# EAGLE design c3_m_4x4 (EAGLE 5.11)
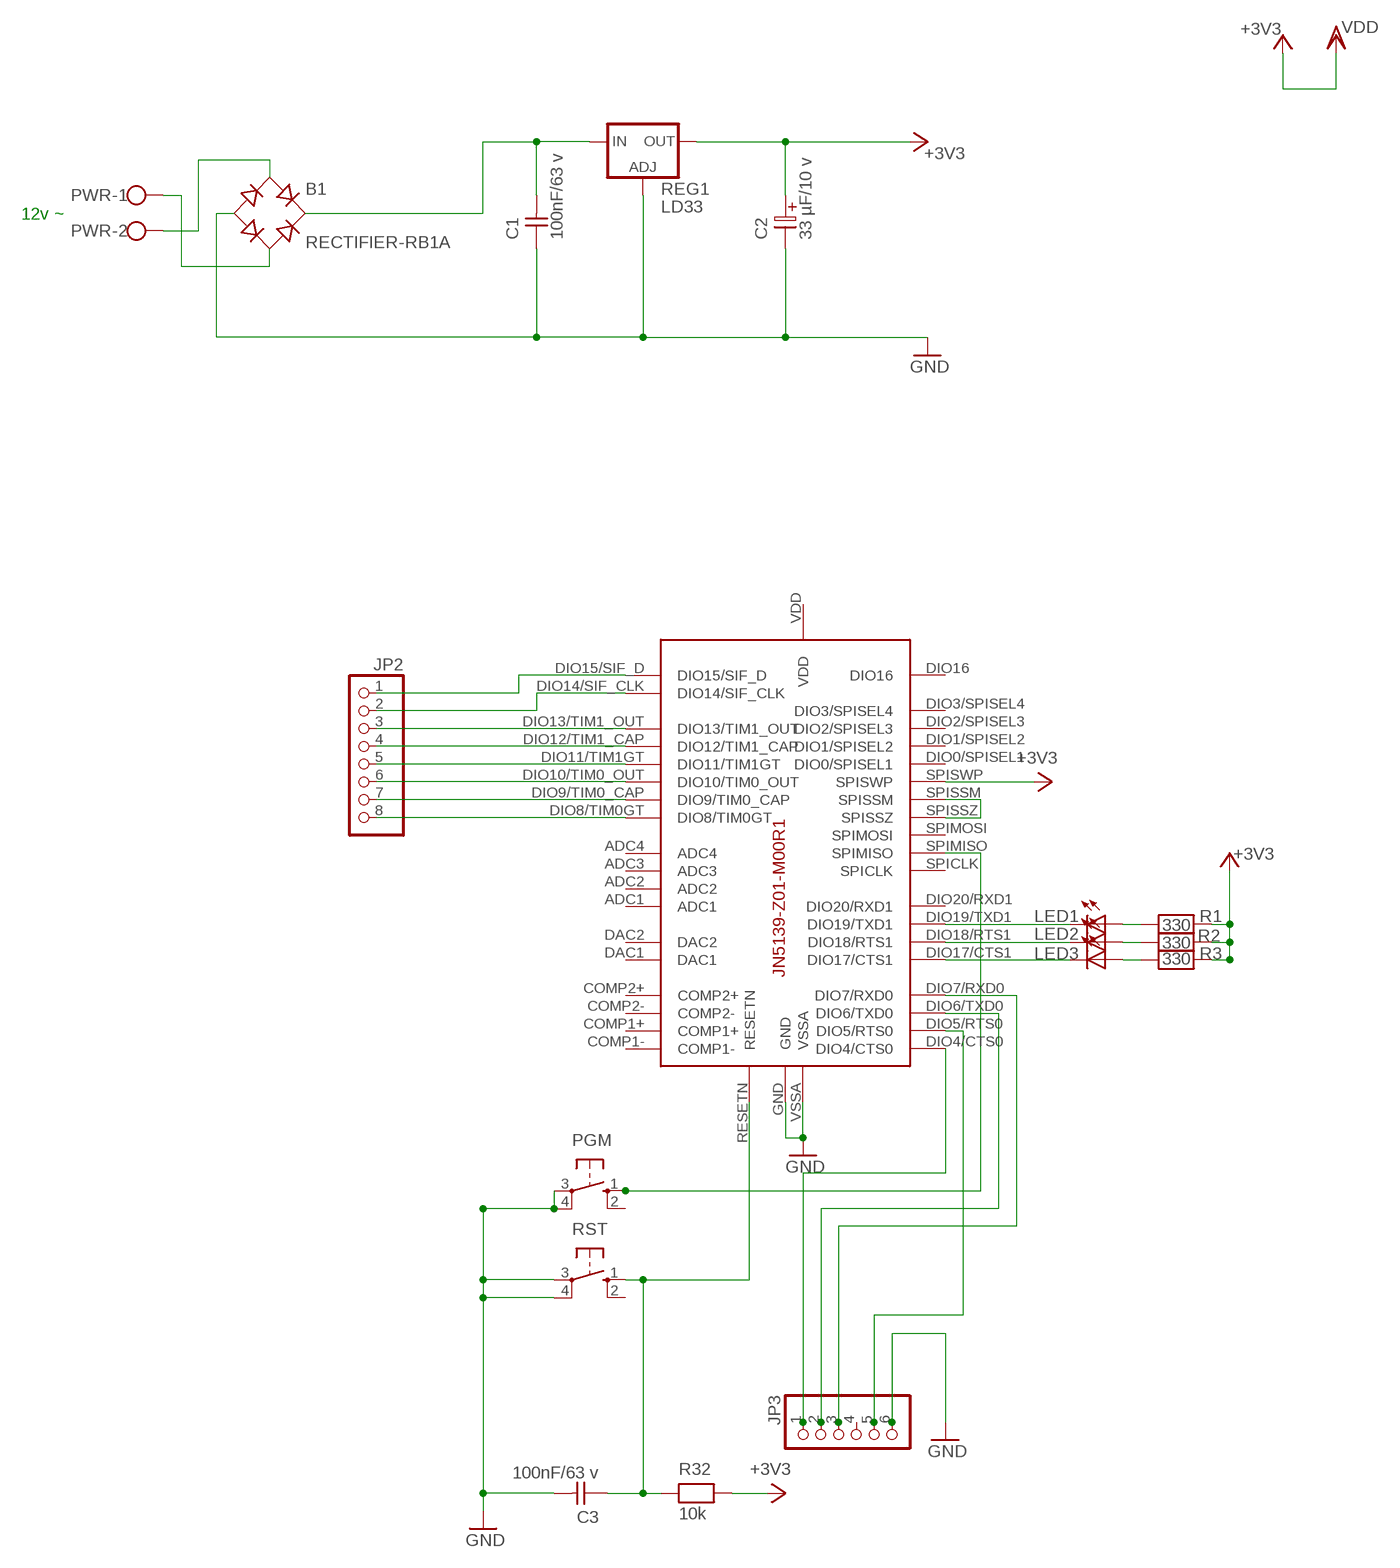
[diagram p0: schematic, sheet 1]

## Parts
B1  RECTIFIER-RB1A  [RB1A]
C1  100nF/63 v  CAPNP-5  [C-5]
C2  33 µF/10 v  ELC-2,5L  [ES-2,5L]
C3  100nF/63 v  CAPNP-5  [C-5]
JP2  PINHD-1X8/90  [1X08/90]
JP3  PINHD-1X6/90  [1X06/90]
LED1  LED5MM  [LED5MM]
LED2  LED5MM  [LED5MM]
LED3  LED5MM  [LED5MM]
PGM  10-XX  [B3F-10XX]
PWR  AK550/2  [AK550/2]
R1  330  RESEU-7,5  [R-7,5]
R2  330  RESEU-7,5  [R-7,5]
R3  330  RESEU-7,5  [R-7,5]
R32  10k  RESEU-7,5  [R-7,5]
REG1  LD33  LM317MBTG  [TO220L1]
RST  10-XX  [B3F-10XX]
U1  JN5139-Z01-M00R1  [JENNIC5139MODULE]

## Nets
+3V3: C2.1 R1.2 R2.2 R3.2 R32.2 REG1.2(OUT) U1.SPISWP ; supply symbol labelled VDD
GND: B1.- C1.1 C2.2 C3.2 JP3.6 PGM.3(P) PGM.4(P1) REG1.1(ADJ) RST.3(P) RST.4(P1) U1.GND U1.VSSA
N$1: JP2.8 U1.DIO8/TIM0GT
N$3: B1.+ C1.2 REG1.3(IN)
N$4: B1.AC1 PWR.2
N$5: B1.AC2 PWR.1
N$6: JP2.7 U1.DIO9/TIM0_CAP
N$7: C3.1 R32.1 RST.1(S) U1.RESETN
N$8: JP2.6 U1.DIO10/TIM0_OUT
N$9: JP2.5 U1.DIO11/TIM1GT
N$10: JP2.4 U1.DIO12/TIM1_CAP
N$11: U1.SPISSM U1.SPISSZ
N$12: JP2.3 U1.DIO13/TIM1_OUT
N$13: JP2.2 U1.DIO14/SIF_CLK
N$14: JP2.1 U1.DIO15/SIF_D
N$15: LED3.K(C) U1.DIO17/CTS1
N$16: LED2.K(C) U1.DIO18/RTS1
N$17: LED1.K(C) U1.DIO19/TXD1
N$18: LED1.A R1.1
N$19: LED2.A R2.1
N$20: LED3.A R3.1
N$67: JP3.2 U1.DIO6/TXD0
N$70: PGM.1(S) U1.SPIMISO
N$73: JP3.1 U1.DIO4/CTS0
N$74: JP3.5 U1.DIO5/RTS0
N$77: JP3.3 U1.DIO7/RXD0
Unconnected: JP3.4 PGM.2(S1) RST.2(S1) U1.ADC1 U1.ADC2 U1.ADC3 U1.ADC4 U1.COMP1+ U1.COMP1- U1.COMP2+ U1.COMP2- U1.DAC1 U1.DAC2 U1.DIO0/SPISEL1 U1.DIO1/SPISEL2 U1.DIO2/SPISEL3 U1.DIO3/SPISEL4 U1.DIO16 U1.DIO20/RXD1 U1.SPICLK U1.SPIMOSI

## Notes on the sheet
- 12v ~

## Power pins joined to a net without a drawn wire
+3V3: U1.VDD

## Library data of the parts
B1 = rectifier:RECTIFIER-: Rectifier
C1 C3 = discrete:CAPNP-5
C2 = discrete:ELC-2,5L
JP2 = pinhead:PINHD-1X8: PIN HEADER
JP3 = pinhead:PINHD-1X6: PIN HEADER
LED1-LED3 = led:LED: LED OSRAM: - CHIPLED LG R971, LG N971, LY N971, LG Q971, LY Q971, LO R971, LY R971 LH N974, LH R974 LS Q976, LO Q976, LY Q976 LO Q996 - Hyper CHIPLED LW Q18S LB Q993, LB Q99A, LB R99A - SideLED LS A670, LO A670, LY A670, LG A670, LP A670 LB A673, LV A673, LT A673, LW A673 LH A674 LY A675 LS A676, LA A676, LO A676, LY A676, LW A676 LS A679, LY A679, LG A679 - Hyper Micro SIDELED® LS Y876, LA Y876, LO Y876, LY Y876 LT Y87S - SmartLED LW L88C, LW L88S LB L89C, LB L89S, LG L890 LS L89K, LO L89K, LY L89K LS L896, LA L896, LO L896, LY L896 - TOPLED LS T670, LO T670, LY T670, LG T670, LP T670 LSG T670, LSP T670, LSY T670, LOP T670, LYG T670 LG T671, LOG T671, LSG T671 LB T673, LV T673, LT T673, LW T673 LH T674 LS T676, LA T676, LO T676, LY T676, LB T676, LH T676, LSB T676, LW T676 LB T67C, LV T67C, LT T67C, LS T67K, LO T67K, LY T67K, LW E67C LS E67B, LA E67B, LO E67B, LY E67B, LB E67C, LV E67C, LT E67C LW T67C LS T679, LY T679, LG T679 LS T770, LO T770, LY T770, LG T770, LP T770 LB T773, LV T773, LT T773, LW T773 LH T774 LS E675, LA E675, LY E675, LS T675 LS T776, LA T776, LO T776, LY T776, LB T776 LHGB T686 LT T68C, LB T68C - Hyper Mini TOPLED® LB M676 - Mini TOPLED Santana® LG M470 LS M47K, LO M47K, LY M47K Source: http://www.osram.convergy.de LUXEON: - LUMILED® LXK2-PW12-R00, LXK2-PW12-S00, LXK2-PW14-U00, LXK2-PW14-V00 LXK2-PM12-R00, LXK2-PM12-S00, LXK2-PM14-U00 LXK2-PE12-Q00, LXK2-PE12-R00, LXK2-PE12-S00, LXK2-PE14-T00, LXK2-PE14-U00 LXK2-PB12-K00, LXK2-PB12-L00, LXK2-PB12-M00, LXK2-PB14-N00, LXK2-PB14-P00, LXK2-PB14-Q00 LXK2-PR12-L00, LXK2-PR12-M00, LXK2-PR14-Q00, LXK2-PR14-R00 LXK2-PD12-Q00, LXK2-PD12-R00, LXK2-PD12-S00 LXK2-PH12-R00, LXK2-PH12-S00 LXK2-PL12-P00, LXK2-PL12-Q00, LXK2-PL12-R00 Source: www.luxeon.com KINGBRIGHT: KA-3528ASYC Source: www.kingbright.com
PGM RST = switch-omron:10-XX: OMRON SWITCH; MPN: B3F-1000; OC_FARNELL: 176432; OC_NEWARK: 36M3542
PWR = con-ptr500+:AK550/2: CONNECTOR
R1-R3 R32 = discrete:RESEU-7,5
REG1 = v-reg:LM317?*: 500 mA Adjustable Output Positive Voltage Regulator Source: http://www.onsemi.co.jp .. LM317M-D.PDF
U1 = jennic:JN5139-Z01-M00R1: Jennic 5139 Zigbee Module

## Net classes
0 default: width 0.406 mm, drill 0.6 mm, clearance 0.254 mm
1 AC_VOLTAGE: width 0.254 mm, drill 0.6 mm, clearance 0.254 mm
2 AC_TERRE: width 1.422 mm, clearance 0.254 mm

## Board
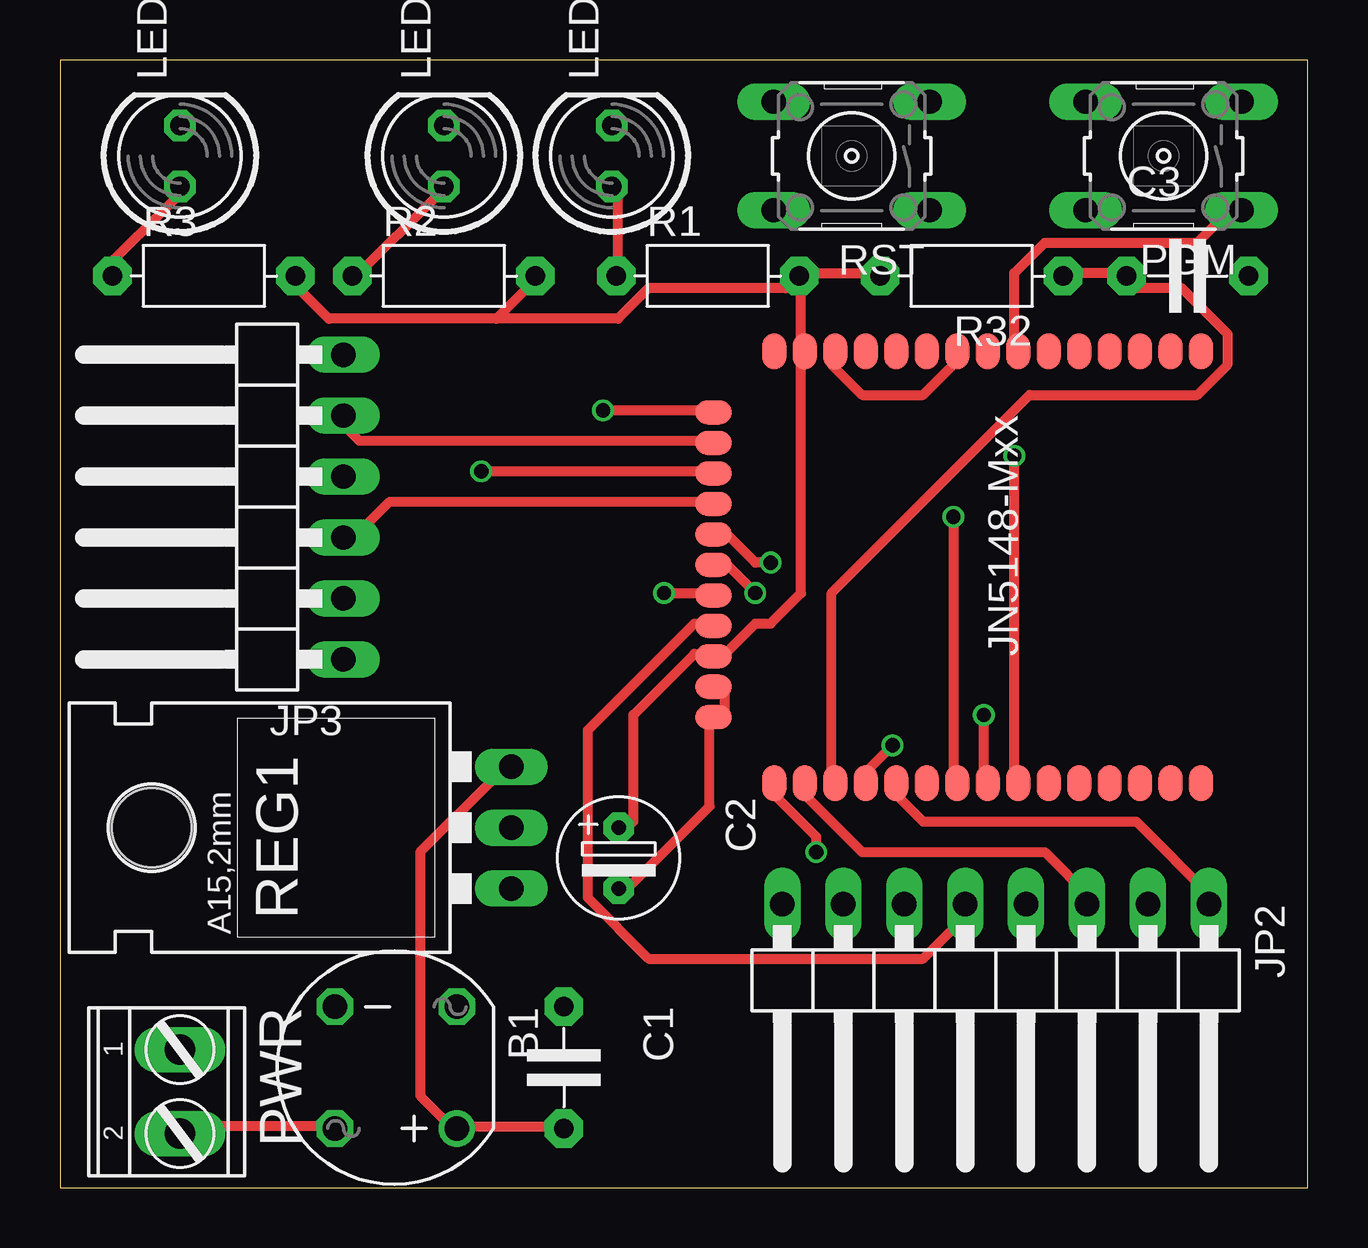
[diagram p1: board, top side]
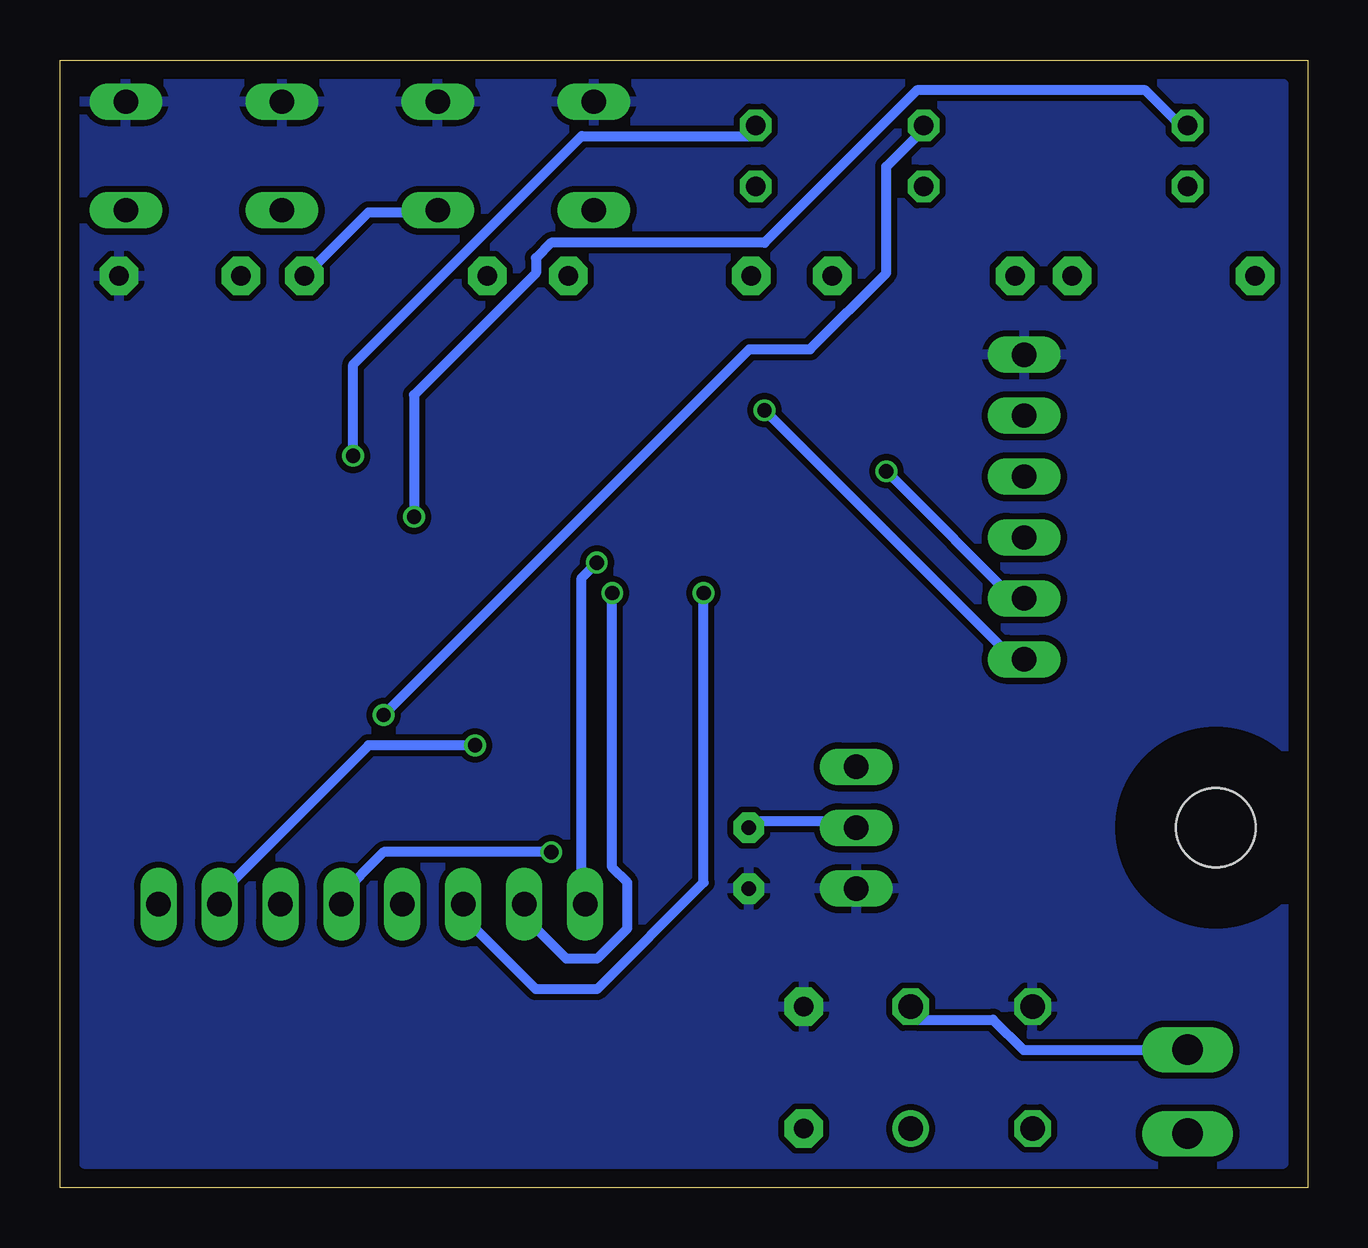
[diagram p2: board, bottom side, seen from below]

Size 52 x 47 mm. Coordinates in mm from the lower left corner, seen from the top.
Outline: 0,0 52,0 52,47 0,47 0,0
Copper layers (1*16): Top 0.035mm / dielectric 1.5mm / Bottom 0.035mm
Design rules "ElecFreaks_CAM_DRC_V1.0": minimum track width 6mil, minimum drill 12mil, track to track 6mil, track to pad 6mil, pad to pad 6mil, via to via 6mil, smd to smd 0mil, copper to edge 10mil, drill to drill 10mil, minimum pad ring 10mil, minimum via ring 6mil, stop-mask expansion 2mil, vias tented up to drill 100mil, thermal gap 10mil

### Footprints (pad centres in the part's own frame; a part is rotated, then mirrored left to right if it is on the bottom)
RB1A = drill 1.016 round: + -2.54,2.54 | drill 1.016 octagon: - 2.54,-2.54; AC1 2.54,2.54; AC2 -2.54,-2.54
C-5 = drill 0.813 pad 1.6 octagon: 1 -2.54,0; 2 2.54,0
ES-2,5L = drill 0.61 pad 1.27 octagon: 1 0,0; 2 2.54,0
1X08/90 = drill 1.016 long: 1 -8.89,-3.81; 2 -6.35,-3.81; 3 -3.81,-3.81; 4 -1.27,-3.81; 5 1.27,-3.81; 6 3.81,-3.81; 7 6.35,-3.81; 8 8.89,-3.81
1X06/90 = drill 1.016 long: 1 -6.35,-3.81; 2 -3.81,-3.81; 3 -1.27,-3.81; 4 1.27,-3.81; 5 3.81,-3.81; 6 6.35,-3.81
LED5MM = drill 0.813 octagon: A -1.27,0; K 1.27,0
B3F-10XX = drill 1.016 long: 1 -3.251,2.261; 2 3.251,2.261; 3 -3.251,-2.261; 4 3.251,-2.261
AK550/2 = drill 1.27 long: 1 -1.75,0; 2 1.75,0
R-7,5 = drill 0.813 pad 1.6 octagon: 1 -3.81,0; 2 3.81,0
TO220L1 = drill 1.016 long: 1 -2.54,-3.81; 2 0,-3.81; 3 2.54,-3.81 | hole 3.302: 0,11.176
JENNIC5139MODULE = smd 1.5 x 1: ADC1 18,17.78; ADC2 18,19.05; ADC3 18,20.32; ADC4 0,20.32; COMP1+ 18,16.51; COMP1- 18,15.24; COMP2+ 0,16.51; COMP2- 0,15.24; DAC1 0,19.05; DAC2 0,17.78; DIO0/SPISEL1 0,8.89; DIO1/SPISEL2 0,7.62; DIO2/SPISEL3 0,6.35; DIO3/SPISEL4 0,2.54; DIO12/TIM1_CAP 18,2.54; DIO13/TIM1_OUT 18,3.81; DIO14/SIF_CLK 18,6.35; DIO15/SIF_D 18,7.62; DIO16 18,8.89; DIO17/CTS1 18,10.16; DIO18/RTS1 18,11.43; DIO19/TXD1 18,12.7; DIO20/RXD1 18,13.97; RESETN 18,5.08; SPICLK 0,13.97; SPIMISO 0,12.7; SPIMOSI 0,11.43; SPISSM 0,5.08; SPISSZ 0,10.16; SPISWP 0,3.81 | smd 1 x 1.5: DIO4/CTS0 2.54,0; DIO5/RTS0 3.81,0; DIO6/TXD0 5.08,0; DIO7/RXD0 6.35,0; DIO8/TIM0GT 7.62,0; DIO9/TIM0_CAP 8.89,0; DIO10/TIM0_OUT 10.16,0; DIO11/TIM1GT 11.43,0; GND 13.97,0; VDD 12.7,0; VSSA 15.24,0

### Placement (x,y rotation side)
B1  14,5 180 top
C1  21,5 270 top
C2  23.29,15 270 top
C3  47,38 0 top
JP2  39,8 180 top
JP3  8,28.36 90 top
LED1  23,43 90 top
LED2  16,43 90 top
LED3  5,43 90 top
PGM  46,43 180 top
PWR  5,4 270 top
R1  27,38 0 top
R2  16,38 0 top
R3  6,38 0 top
R32  38,38 180 top
REG1  15,15 90 top
RST  33,43 180 top
U1  27.24,34.84 270 top

### Tracks (layer width: path | path; a pad name or v marks a point on that pad's centre or on a via)
+3V3
  Top 0.406: C2.1 23.91,15.26 23.91,19.7 26.45,22.24 27.08,22.24 U1.VDD 27.71,22.24 28.98,23.51 29.62,23.51 30.89,24.78 30.89,34.3 U1.SPISWP 30.89,34.94 30.89,37.48 R1.2 | R32.2 34.06,38.11 30.89,38.11 R1.2 | 18.19,36.21 11.21,36.21 9.94,37.48 R3.2 | 18.19,36.21 19.46,37.48 R2.2 | 18.19,36.21 23.27,36.21 24.54,37.48 30.26,37.48 R1.2
  Bottom 0.406: REG1.2 18.82,15.26 23.27,15.26 C2.1
GND
  Top 0.406: U1.GND 27.71,20.97 27.71,19.7 U1.VSSA 27.08,19.7 27.08,15.89 23.91,12.71 C2.2
  pour Bottom: 1,46 51,46 51,1 1,1
N$1  (via drill 0.6)
  Top 0.406: v29.62,26.05 28.98,26.05 27.71,27.32 U1.DIO8/TIM0GT
  Bottom 0.406: v29.62,26.05 30.26,25.41 30.26,12.08 JP2.8
N$3
  Top 0.406: C1.2 20.73,2.55 16.92,2.55 B1.+ 16.29,2.55 15.02,3.83 15.02,13.98 18.19,17.16 REG1.3
N$4
  Top 0.406: B1.AC1 11.21,2.55 5.49,2.55 PWR.2
N$5
  Bottom 0.406: B1.AC2 16.29,7 13.11,7 11.84,5.73 5.49,5.73 PWR.1
N$6  (via drill 0.6)
  Top 0.406: v28.98,24.78 27.71,26.05 U1.DIO9/TIM0_CAP
  Bottom 0.406: v28.98,24.78 28.98,13.35 28.35,12.71 28.35,10.81 29.62,9.54 30.89,9.54 32.8,11.45 JP2.7
N$7
  Top 0.406: U1.RESETN 32.16,17.16 32.16,24.78 40.41,33.03 47.4,33.03 48.67,34.3 48.67,35.58 46.77,37.48 44.86,37.48 C3.1 44.23,38.11 42.32,38.11 R32.1
  Bottom 0.406: RST.1 36.61,40.66 39.14,40.66 41.69,38.11 R32.1
N$8  (via drill 0.6)
  Top 0.406: v25.18,24.78 27.08,24.78 U1.DIO10/TIM0_OUT
  Bottom 0.406: v25.18,24.78 25.18,12.71 29.62,8.27 32.16,8.27 35.34,11.45 JP2.6
N$9
  Top 0.406: U1.DIO11/TIM1GT 27.08,23.51 26.45,23.51 22,19.06 22,12.08 24.54,9.54 35.97,9.54 37.88,11.45 JP2.5
N$10  (via drill 0.6)
  Top 0.406: v31.52,13.98 31.52,14.62 29.62,16.52 U1.DIO12/TIM1_CAP
  Bottom 0.406: v31.52,13.98 38.51,13.98 40.41,12.08 JP2.4
N$11
  Top 0.406: U1.SPISSM 32.16,34.3 33.43,33.03 35.97,33.03 37.24,34.3 U1.SPISSZ
N$12
  Top 0.406: U1.DIO13/TIM1_OUT 30.89,16.52 33.43,13.98 41.05,13.98 42.95,12.08 JP2.3
N$13  (via drill 0.6)
  Top 0.406: v34.7,18.43 33.43,17.16 U1.DIO14/SIF_CLK
  Bottom 0.406: v34.7,18.43 39.14,18.43 45.5,12.08 JP2.2
N$14
  Top 0.406: U1.DIO15/SIF_D 34.7,16.52 35.97,15.26 44.86,15.26 48.03,12.08 JP2.1
N$15  (via drill 0.6)
  Top 0.406: v37.24,27.95 37.24,17.16 U1.DIO17/CTS1
  Bottom 0.406: v37.24,27.95 37.24,33.03 32.16,38.11 32.16,38.75 31.52,39.38 22.64,39.38 16.29,45.73 6.76,45.73 5.49,44.47 LED3.K
N$16  (via drill 0.6)
  Top 0.406: v38.51,19.7 38.51,17.16 U1.DIO18/RTS1
  Bottom 0.406: v38.51,19.7 23.27,34.94 20.73,34.94 17.55,38.11 17.55,42.56 16.29,43.83 LED2.K
N$17  (via drill 0.6)
  Top 0.406: v39.78,30.5 39.78,17.16 U1.DIO19/TXD1
  Bottom 0.406: v39.78,30.5 39.78,34.3 30.26,43.83 23.27,43.83 LED1.K
N$18
  Top 0.406: LED1.A 23.27,41.29 23.27,38.11 R1.1
N$19
  Top 0.406: LED2.A 15.65,41.29 12.47,38.11 R2.1
N$20
  Top 0.406: LED3.A 4.86,41.29 1.68,38.11 R3.1
N$67  (via drill 0.6)
  Top 0.406: v17.55,29.86 27.08,29.86 U1.DIO6/TXD0
  Bottom 0.406: v17.55,29.86 11.84,24.14 JP3.2
N$70
  Top 0.406: U1.SPIMISO 39.78,34.94 39.78,38.11 41.05,39.38 47.4,39.38 48.67,40.66 PGM.1
N$73  (via drill 0.6)
  Top 0.406: v22.64,32.4 27.08,32.4 U1.DIO4/CTS0
  Bottom 0.406: v22.64,32.4 11.84,21.61 JP3.1
N$74
  Top 0.406: U1.DIO5/RTS0 27.08,31.13 12.47,31.13 11.84,31.77 JP3.5
N$77
  Top 0.406: U1.DIO7/RXD0 27.08,28.59 13.74,28.59 11.84,26.68 JP3.3